# EAGLE design tdo_frontend (EAGLE 9.6.2)
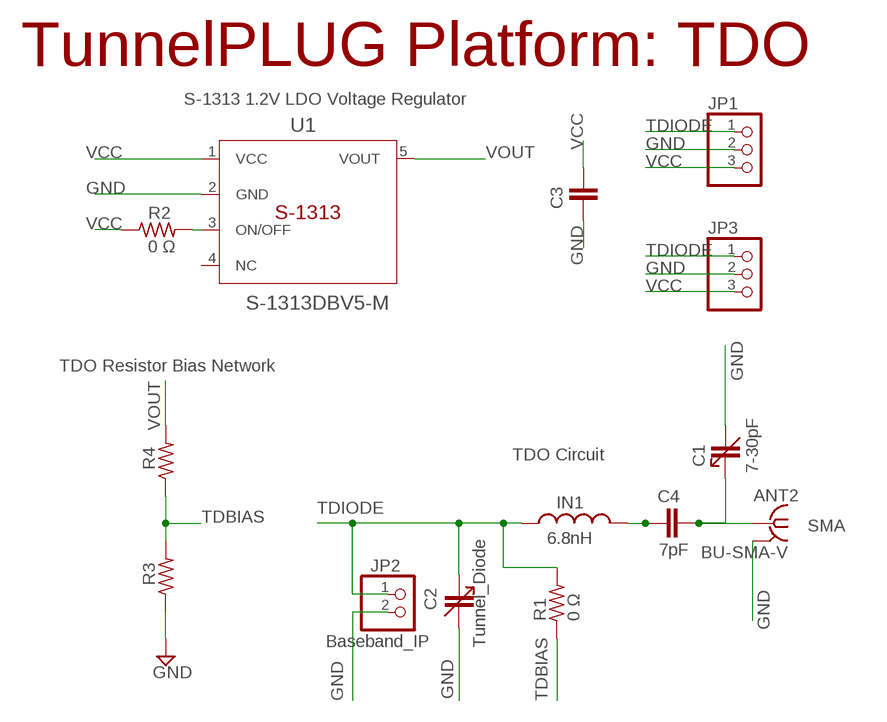
[diagram p0: schematic, sheet 1]

## Parts
C1  7-30pF  CAP_ADJSMD  [CTZ3]
C2  7-30pF  CAP_ADJSMD  [CTZ3]
C3  CAPACITOR  [C0603]
C4  7pF  CAPACITOR  [C0603]
IN1  6.8nH  0603_1  [0603_1PRIMARY]
JP1  PINHD-1X3/90  [1X03/90]
JP2  Baseband_IP  PINHD-1X2/LONG  [1X02]
JP3  PINHD-1X3/LONG  [1X03]
R1  0 Ω  R-US_R0603  [R0603]
R2  0 Ω  R-US_R0603  [R0603]
R3  R-US_R0603  [R0603]
R4  R-US_R0603  [R0603]
SMA  BU-SMA-V  [BU-SMA-V]
U1  S-1313DBV5-M  [DBV5-M]

## Nets
ANT2: C1.+ C4.2 SMA.1
GND: C1.- C2.- C3.1 JP1.2 JP2.2 JP3.2 R3.1 SMA.2 SMA.3 SMA.4 SMA.5 U1.2(GND)
N$1: R2.2 U1.3(ON/OFF)
N$2: C4.1 IN1.2
TDBIAS: R1.1 R3.2 R4.1
TDIODE: C2.+ IN1.1 JP1.1 JP2.1 JP3.1 R1.2
VCC: C3.2 JP1.3 JP3.3 R2.1 U1.1(VCC)
VOUT: R4.2 U1.5(VOUT)
Unconnected: U1.4(NC)

## Notes on the sheet
- TunnelPLUG Platform: TDO
- S-1313 1.2V LDO Voltage Regulator
- TDO Resistor Bias Network
- TDO Circuit
- Tunnel_Diode

## Library data of the parts
C1 C2 = SparkFun-Capacitors:CAP_ADJ: Variable, non-polarized capacitor
C3 C4 = Moo1.2:CAPACITOR
IN1 = Moo1.2:0603_1
JP1 = pinhead:PINHD-1X3: PIN HEADER
JP2 = pin_header:PINHD-1X2: PIN HEADER
JP3 = pin_header:PINHD-1X3: PIN HEADER
R1-R4 = rcl:R-US_: RESISTOR, American symbol; SPICEPREFIX: R
SMA = con-coax:BU-SMA-V: FEMALE SMA CONNECTOR Radiall distributor RS 112-3794; OC_FARNELL: unknown; OC_NEWARK: unknown
U1 = S-1313:S-1313: S-1313; DATASHEET_URL: http://www.ti.com/lit/gpn/SN74LVC1G32-Q1; DESCRIPTION: Automotive Catalog Single 2-Input Positive-OR Gate; FAMILY_NAME: LL OR GATE; GENERIC_PART_NUMBER: SN74LVC1G32-Q1; INDUSTRY_STD_PKG_TYPE: SOT-23; MANUFACTURER: Texas Instruments; MANUFACTURER_PART_NUMBER: SN74LVC1G32QDBVRQ1; PACKAGE_DESIGNATOR: DBV; PIN_COUNT: 5; VENDOR: Texas Instruments

## Board
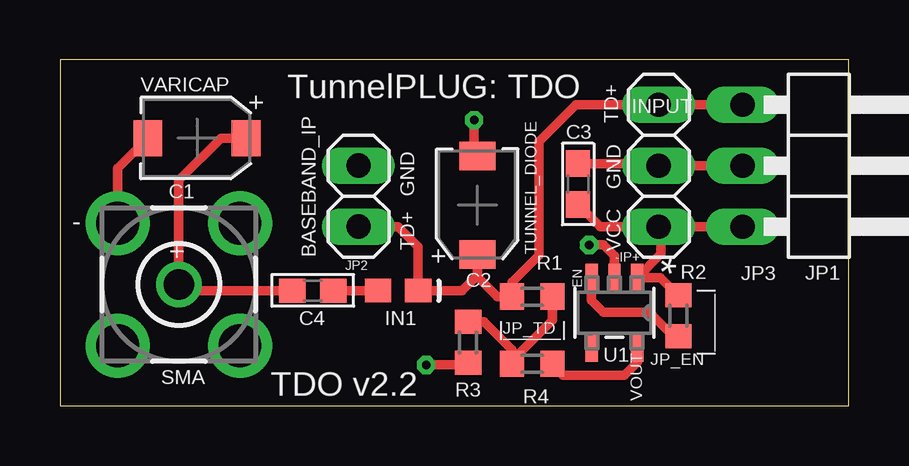
[diagram p1: board, top side]
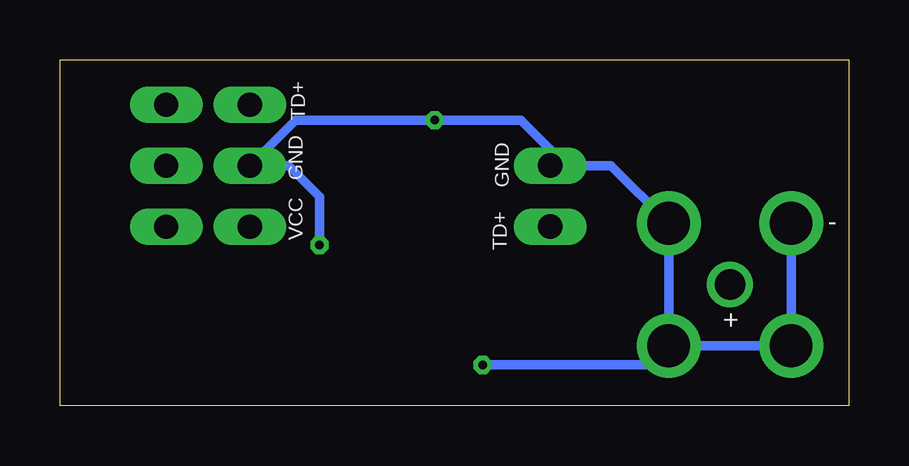
[diagram p2: board, bottom side, seen from below]

Size 32.88 x 14.41 mm. Coordinates in mm from the lower left corner, seen from the top.
Outline: 0,0 32.88,0 32.88,14.41 0,14.41 0,0
Copper layers (1*16): Top 0.035mm / dielectric 1.5mm / Bottom 0.035mm
Design rules "default *": minimum track width 6mil, minimum drill 0.35mm, track to track 10mil, track to pad 10mil, pad to pad 10mil, via to via 10mil, smd to smd 10mil, copper to edge 40mil, drill to drill 6mil, minimum pad ring 10mil, minimum via ring 8mil, stop-mask expansion 4mil, vias tented up to drill 0mil, thermal gap 10mil

### Footprints (pad centres in the part's own frame; a part is rotated, then mirrored left to right if it is on the bottom)
CTZ3 = smd 1.5 x 1.2: + 0,2.05; - 0,-2.05
C0603 = smd 1.1 x 1: 1 -0.85,0; 2 0.85,0
0603_1PRIMARY = smd 1.092 x 0.991: 1 -0.838,0; 2 0.838,0
1X03/90 = drill 1.016 long: 1 -2.54,-3.81; 2 0,-3.81; 3 2.54,-3.81
1X02 = drill 1.016 long: 1 -1.27,0; 2 1.27,0
1X03 = drill 1.016 long: 1 -2.54,0; 2 0,0; 3 2.54,0
R0603 = smd 1 x 1.1: 1 -0.85,0; 2 0.85,0
BU-SMA-V = drill 1.27: 1 0,0 | drill 1.778: 2 -2.55,2.55; 3 2.55,2.55; 4 2.55,-2.55; 5 -2.55,-2.55
DBV5-M = smd 1.172 x 0.508: 1 -1.462,0.95; 2 -1.462,0; 3 -1.462,-0.95; 4 1.462,-0.95; 5 1.462,0.95

### Placement (x,y rotation side)
C1  5.72,11.15 270 top
C2  17.4,8.36 180 top
C3  21.6,9.24 270 top
C4  10.54,4.8 180 top
IN1  14.1,4.8 180 top
JP1  32.26,10 270 top
JP2  12.45,8.74 90 top
JP3  24.96,10 270 top
R1  19.69,4.54 180 top
R2  25.78,3.75 270 top
R3  17.02,2.64 90 top
R4  19.69,1.75 0 top
SMA  4.95,5.05 0 top
U1  23.11,3.88 270 top

### Tracks (layer width: path | path; a pad name or v marks a point on that pad's centre or on a via)
ANT2
  Top 0.4: C1.+ 6.71,11.15 4.95,9.39 SMA.1 5.21,4.8 C4.2
GND  (via drill 0.35)
  Top 0.4: SMA.2 2.4,9.89 C1.- | R3.1 16.93,1.7 v15.26,1.7 | C2.- 17.26,10.54 v17.26,11.9 | v22.06,6.7 22.66,6.7 23.11,6.25 U1.2 | JP3.2 25.16,10 | 25.16,10 JP1.2 | C3.1 25.08,10.09 25.16,10
  Bottom 0.4: SMA.4 SMA.3 9.91,10.01 JP2.2 12.45,10.68 13.66,11.9 v17.26,11.9 23.06,11.9 JP3.2 23.35,10 22.06,8.71 v22.06,6.7 | SMA.4 SMA.5 SMA.2 | v15.26,1.7 8.31,1.7 SMA.4
N$1
  Top 0.4: U1.3 22.16,4.4 22.66,3.9 24.58,3.9 25.58,2.9 R2.2
N$2
  Top 0.4: C4.1 IN1.2
TDBIAS
  Top 0.4: R3.2 17.67,3.49 18.84,2.33 R4.1 18.84,1.87 20.54,3.57 R1.1
TDIODE
  Top 0.4: JP2.1 14.1,7.47 14.94,6.63 IN1.1 16.76,4.8 17.4,5.43 C2.+ 17.4,5.38 18.23,4.54 R1.2 18.84,5.14 19.96,6.27 19.96,11 21.5,12.54 JP3.1 JP1.1
VCC
  Top 0.4: R2.1 25.04,5.34 U1.1 25.05,6.33 25.05,7.37 JP3.3 | JP3.3 22.52,7.46 C3.2 | JP3.3 JP1.3
VOUT
  Top 0.4: R4.2 20.54,1.7 20.96,1.27 23.53,1.27 24.06,1.81 U1.5

### Text on the board
tNames: VARICAP | TunnelPLUG: TDO | TD+ | INPUT | + | GND | GND | - | TD+ | VCC | + | BASEBAND_IP | + | TUNNEL_DIODE | EN | -IP+ | |_____| | |_____| | JP_TD | VOUT | JP_EN | TDO v2.2
bNames: TD+ | GND | GND | - | TD+ | VCC | +